# EAGLE design HTVC8038_4LayerBoard_v3 (EAGLE 7.4.0)
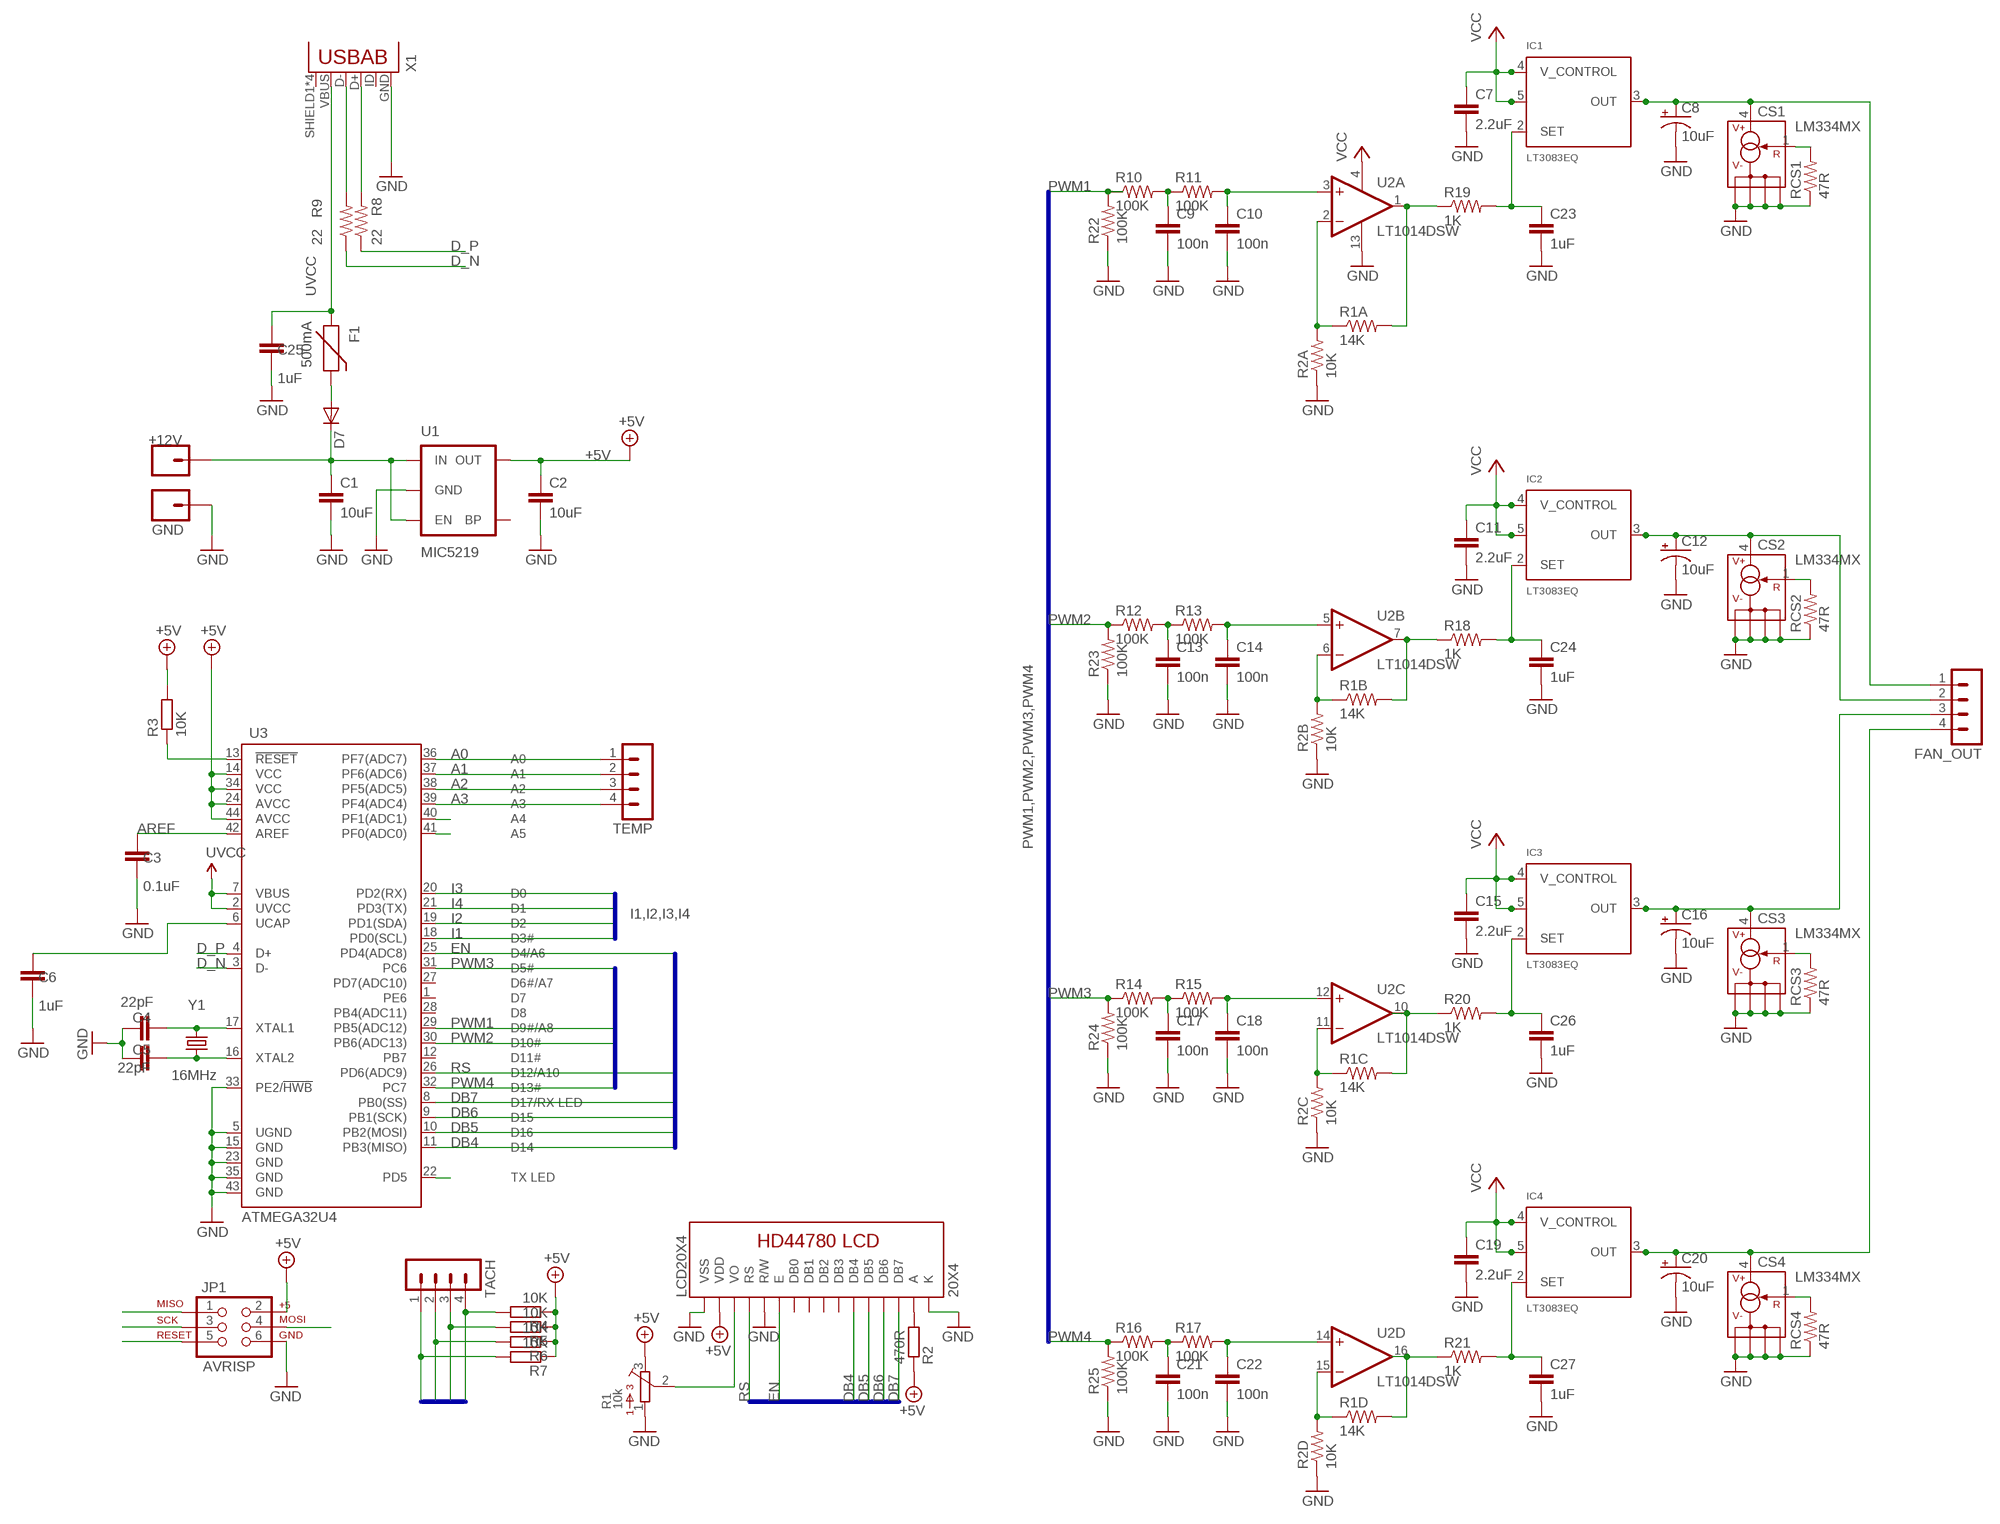
[diagram p0: schematic, sheet 1]

## Parts
+12V  +12V  M01PTH  [1X01]
C1  10uF  C-EUC1206  [C1206]
C2  10uF  C-EUC1206  [C1206]
C3  0.1uF  C-EUC0805  [C0805]
C4  22pF  C-EUC0805  [C0805]
C5  22pF  C-EUC0805  [C0805]
C6  1uF  C-EUC0805  [C0805]
C7  2.2uF  C-EUC1206  [C1206]
C8  10uF  CPOL-USCT3528  [CT3528]
C9  100n  C-EUC0805  [C0805]
C10  100n  C-EUC0805  [C0805]
C11  2.2uF  C-EUC1206  [C1206]
C12  10uF  CPOL-USCT3528  [CT3528]
C13  100n  C-EUC0805  [C0805]
C14  100n  C-EUC0805  [C0805]
C15  2.2uF  C-EUC1206  [C1206]
C16  10uF  CPOL-USCT3528  [CT3528]
C17  100n  C-EUC0805  [C0805]
C18  100n  C-EUC0805  [C0805]
C19  2.2uF  C-EUC1206  [C1206]
C20  10uF  CPOL-USCT3528  [CT3528]
C21  100n  C-EUC0805  [C0805]
C22  100n  C-EUC0805  [C0805]
C23  1uF  C-EUC0805  [C0805]
C24  1uF  C-EUC0805  [C0805]
C25  1uF  C-EUC0805  [C0805]
C26  1uF  C-EUC0805  [C0805]
C27  1uF  C-EUC0805  [C0805]
CS1  LM334MX  [SO08]
CS2  LM334MX  [SO08]
CS3  LM334MX  [SO08]
CS4  LM334MX  [SO08]
D7  DIODESOD  [SOD-323]
F1  500mA  PTCSMD  [PTC-1206]
FAN_OUT  MA04-1  [MA04-1]
GND  GND  M01PTH  [1X01]
IC1  LT3083EQ  [DDPAK_TO263-5]
IC2  LT3083EQ  [DDPAK_TO263-5]
IC3  LT3083EQ  [DDPAK_TO263-5]
IC4  LT3083EQ  [DDPAK_TO263-5]
JP1  AVRISP  AVR_SPI_PRG_6NS  [2X3-NS]
LCD20X4  20X4  LCD-HD447804-HOLES20X4-4HOLES  [LCD-20X4-4HOLES]
R1  10k  3362P  [3362P]
R1A  14K  R-US_R0603  [R0603]
R1B  14K  R-US_R0603  [R0603]
R1C  14K  R-US_R0603  [R0603]
R1D  14K  R-US_R0603  [R0603]
R2  470R  R-EU_R0805  [R0805]
R2A  10K  R-US_R0805  [R0805]
R2B  10K  R-US_R0805  [R0805]
R2C  10K  R-US_R0805  [R0805]
R2D  10K  R-US_R0805  [R0805]
R3  10K  R-EU_R0805  [R0805]
R4  10K  R-EU_R0805  [R0805]
R5  10K  R-EU_R0805  [R0805]
R6  10K  R-EU_R0805  [R0805]
R7  10K  R-EU_R0805  [R0805]
R8  22  R-US_R0603  [R0603]
R9  22  R-US_R0603  [R0603]
R10  100K  R-US_R0805  [R0805]
R11  100K  R-US_R0805  [R0805]
R12  100K  R-US_R0805  [R0805]
R13  100K  R-US_R0805  [R0805]
R14  100K  R-US_R0805  [R0805]
R15  100K  R-US_R0805  [R0805]
R16  100K  R-US_R0805  [R0805]
R17  100K  R-US_R0805  [R0805]
R18  1K  R-US_R0805  [R0805]
R19  1K  R-US_R0805  [R0805]
R20  1K  R-US_R0805  [R0805]
R21  1K  R-US_R0805  [R0805]
R22  100K  R-US_R0805  [R0805]
R23  100K  R-US_R0805  [R0805]
R24  100K  R-US_R0805  [R0805]
R25  100K  R-US_R0805  [R0805]
RCS1  47R  R-US_R0805  [R0805]
RCS2  47R  R-US_R0805  [R0805]
RCS3  47R  R-US_R0805  [R0805]
RCS4  47R  R-US_R0805  [R0805]
TACH  MA04-1  [MA04-1]
TEMP  MA04-1  [MA04-1]
U1  MIC5219  V_REG_LDOSMD  [SOT23-5]
U2  LT1014DSW  [SO16W]
U3  ATMEGA32U4  ATMEGA32U4TQFP  [SPARKFUN-DIGITALIC_TQFP44]
X1  USB-AB  [USB-AB-MICRO-SMD]
Y1  16MHz  CRYSTAL5X3  [CRYSTAL-SMD-5X3]

## Nets
+5V: C2.1 JP1.2 LCD20X4.P$2(VDD) R1.3 R2.1 R3.2 R4.1 R5.1 R6.1 R7.1 U1.5(OUT) U3.14(VCC) U3.24(AVCC) U3.34(VCC) U3.44(AVCC)
A0: TEMP.1 U3.36(PF7(ADC7))
A1: TEMP.2 U3.37(PF6(ADC6))
A2: TEMP.3 U3.38(PF5(ADC5))
A3: TEMP.4 U3.39(PF4(ADC4))
A4: U3.40(PF1(ADC1))
A5: U3.41(PF0(ADC0))
AREF: C3.2 U3.42(AREF)
D_N: R9.1 U3.3(D-)
D_P: R8.1 U3.4(D+)
DB4: JP1.1 LCD20X4.P$11(DB4) U3.11(PB3(MISO))
DB5: JP1.4 LCD20X4.P$12(DB5) U3.10(PB2(MOSI))
DB6: JP1.3 LCD20X4.P$13(DB6) U3.9(PB1(SCK))
DB7: LCD20X4.P$14(DB7) U3.8(PB0(SS))
EN: LCD20X4.P$6(E) U3.25(PD4(ADC8))
GND: C1.2 C2.2 C3.1 C4.2 C5.2 C6.1 C7.2 C8.- C9.2 C10.2 C11.2 C12.- C13.2 C14.2 C15.2 C16.- C17.2 C18.2 C19.2 C20.- C21.2 C22.2 C23.2 C24.2 C25.1 C26.2 C27.2 CS1.2(V-) CS1.3(V-) CS1.6(V-) CS1.7(V-) CS2.2(V-) CS2.3(V-) CS2.6(V-) CS2.7(V-) CS3.2(V-) CS3.3(V-) CS3.6(V-) CS3.7(V-) CS4.2(V-) CS4.3(V-) CS4.6(V-) CS4.7(V-) GND.1 JP1.6 LCD20X4.P$1(VSS) LCD20X4.P$5(R/W) LCD20X4.P$16(K) R1.1 R2A.1 R2B.1 R2C.1 R2D.1 R22.1 R23.1 R24.1 R25.1 RCS1.1 RCS2.1 RCS3.1 RCS4.1 U1.2(GND) U2.13(P:V-) U3.5(UGND) U3.15(GND) U3.23(GND) U3.33(PE2/!HWB) U3.35(GND) U3.43(GND) X1.GND
I1: R7.2 TACH.1 U3.18(PD0(SCL))
I2: R6.2 TACH.2 U3.19(PD1(SDA))
I3: R5.2 TACH.3 U3.20(PD2(RX))
I4: R4.2 TACH.4 U3.21(PD3(TX))
N$1: R1A.1 R2A.2 U2.2(A:-IN)
N$2: R1B.1 R2B.2 U2.6(B:-IN)
N$3: R1C.1 R2C.2 U2.11(C:-IN)
N$4: R1D.1 R2D.2 U2.15(D:-IN)
N$5: C9.1 R10.2 R11.1
N$6: C13.1 R12.2 R13.1
N$7: LCD20X4.P$3(VO) R1.2
N$8: LCD20X4.P$15(A) R2.2
N$9: C5.1 U3.16(XTAL2) Y1.1
N$10: C4.1 U3.17(XTAL1) Y1.3
N$11: D7.2(A) F1.2
N$12: C6.2 U3.6(UCAP)
N$15: C17.1 R14.2 R15.1
N$16: C21.1 R16.2 R17.1
N$18: CS1.1(R) RCS1.2
N$19: CS2.1(R) RCS2.2
N$20: CS3.1(R) RCS3.2
N$21: CS4.1(R) RCS4.2
N$22: C27.1 IC4.2(SET) R21.2
N$23: C23.1 IC1.2(SET) R19.2
N$24: R1B.2 R18.1 U2.7(B:OUT)
N$25: C26.1 IC3.2(SET) R20.2
OPAMP1: C10.1 R11.2 U2.3(A:+IN)
OPAMP2: C14.1 R13.2 U2.5(B:+IN)
OPAMP3: C18.1 R15.2 U2.12(C:+IN)
OPAMP4: C22.1 R17.2 U2.14(D:+IN)
OUT1: C8.+ CS1.4(V+) FAN_OUT.1 IC1.3(OUT) IC1.6(OUT)
OUT2: C12.+ CS2.4(V+) FAN_OUT.2 IC2.3(OUT) IC2.6(OUT)
OUT3: C16.+ CS3.4(V+) FAN_OUT.3 IC3.3(OUT) IC3.6(OUT)
OUT4: C20.+ CS4.4(V+) FAN_OUT.4 IC4.3(OUT) IC4.6(OUT)
PWM1: R10.1 R22.2 U3.29(PB5(ADC12))
PWM2: R12.1 R23.2 U3.30(PB6(ADC13))
PWM3: R14.1 R24.2 U3.31(PC6)
PWM4: R16.1 R25.2 U3.32(PC7)
RESET: JP1.5 R3.1 U3.13(!RESET)
RS: LCD20X4.P$4(RS) U3.26(PD6(ADC9))
SET1: R1A.2 R19.1 U2.1(A:OUT)
SET2: C24.1 IC2.2(SET) R18.2
SET3: R1C.2 R20.1 U2.10(C:OUT)
SET4: R1D.2 R21.1 U2.16(D:OUT)
TXLED: U3.22(PD5)
USB_N: R9.2 X1.D-
USB_P: R8.2 X1.D+
UVCC: C25.2 F1.1 U3.2(UVCC) U3.7(VBUS) X1.VBUS
VCC: +12V.1 C1.1 C7.1 C11.1 C15.1 C19.1 D7.1(C) IC1.4(V_CONTROL) IC1.5(IN) IC2.4(V_CONTROL) IC2.5(IN) IC3.4(V_CONTROL) IC3.5(IN) IC4.4(V_CONTROL) IC4.5(IN) U1.1(IN) U1.3(EN) U2.4(P:V+)
Unconnected: LCD20X4.P$7(DB0) LCD20X4.P$8(DB1) LCD20X4.P$9(DB2) LCD20X4.P$10(DB3) U1.4(BP) U3.1(PE6) U3.12(PB7) U3.27(PD7(ADC10)) U3.28(PB4(ADC11)) X1.ID(USBID) X1.SHIELD1(SHIELD) X1.SHIELD2(SHIELD) X1.SHIELD3(SHIELD) X1.SHIELD4(SHIELD)

## Buses
RS,EN,DB4,DB5,DB6,DB7
PWM1,PWM2,PWM3,PWM4
I1,I2,I3,I4

## Library data of the parts
+12V GND = SparkFun-Connectors:M01: Header 1 Standard 1-pin 0.1" header. Use with straight break away headers (SKU : PRT-00116), right angle break away headers (PRT-00553), swiss pins (PRT-00743), machine pins (PRT-00117), and female headers (PRT-00115).
C1-C7 C11 C15 C19 C25 = rcl:C-EU: CAPACITOR, European symbol
C8 C12 C16 C20 = rcl:CPOL-US: POLARIZED CAPACITOR, American symbol
C9 C10 C13 C14 C17 C18 C21-C24 C26 C27 = resistor:C-EU: CAPACITOR, European symbol
CS1-CS4 = linear:LM334*: 3-Terminal Adjustable Current Sources Source: www.national.com/pf/LM/LM334.html | LM134.pdf
D7 = SparkFun:DIODE: Diode These are standard reverse protection diodes and small signal diodes. SMA package can handle up to about 1A. SOD-323 can handle about 200mA. What the SOD-323 package when ordering, there are some mfgs out there that are 5-pin packages.
F1 = SparkFun:PTC: Resettable Fuse PTC Resettable Fuse. Spark Fun Electronics SKU : COM-08357
FAN_OUT TACH TEMP = con-lstb:MA04-1: PIN HEADER; OC_FARNELL: unknown; OC_NEWARK: unknown
IC1-IC4 = nervus:LT3083
JP1 = SparkFun-Connectors:AVR_SPI_PRG_6: AVR ISP 6 Pin This is the reduced ISP connector for AVR programming. Common on Arduino. This footprint will take up less PCB space and can be used with a 10-pin to 6-pin adapter such as SKU: BOB-08508 **Special note about "TEST_POINT" package. The stop mask is on the top side, so if you want your programming test points to be on the bottom of your board, make sure to place this package on the bottom side of the board. This also ensure that the orientation to program from the bottom side will be correct.
LCD20X4 = HD44780LCD-2:LCD-HD44780
R1 = nervus:3362: 3362 Series 1/4" Square Trimmer
R1A R1B R1C R1D R8 R9 = rcl:R-US_: RESISTOR, American symbol
R2-R7 = rcl:R-EU_: RESISTOR, European symbol
R2A R2B R2C R2D R10-R25 RCS1-RCS4 = resistor:R-US_: RESISTOR, American symbol
U1 = SparkFun:V_REG_LDO: Voltage Regulator LDO Standard 150mA LDO voltage regulator in SOT-23 layout. Micrel part MIC5205. BP (by-pass) pin is used to lower output noise with 470pF cap.
U2 = nervus:LT1014: Quad Precision Op AmpDatasheet <http://cds.linear.com/docs/en/datasheet/10134fd.pdf>
U3 = SparkFun-Retired:ATMEGA32U4: Atmel 44-pin 8-bit Microcontroller with 32KBytes of ISP Flash and USB Controller ----- Please use the QFN-44-NOPAD_1:1 package for the footprint of all boards using a 32U4. Route traces directly away from the pads as much as possible.; PROD_ID: IC-11161
X1 = nervus:USB-AB: This is a USB AB connector that is compatible with USB OTG. i.e. this connector can serve as a host or device
Y1 = SparkFun:CRYSTAL: Crystals Various standard crystals. Proven footprints. Spark Fun Electronics SKU : COM-00534

## Net classes
0 default: width 0.203 mm
1 VCC: width 0.813 mm, drill 0.406 mm, clearance 0.406 mm
2 GND: width 0.813 mm, drill 0.406 mm, clearance 0.406 mm

## Board
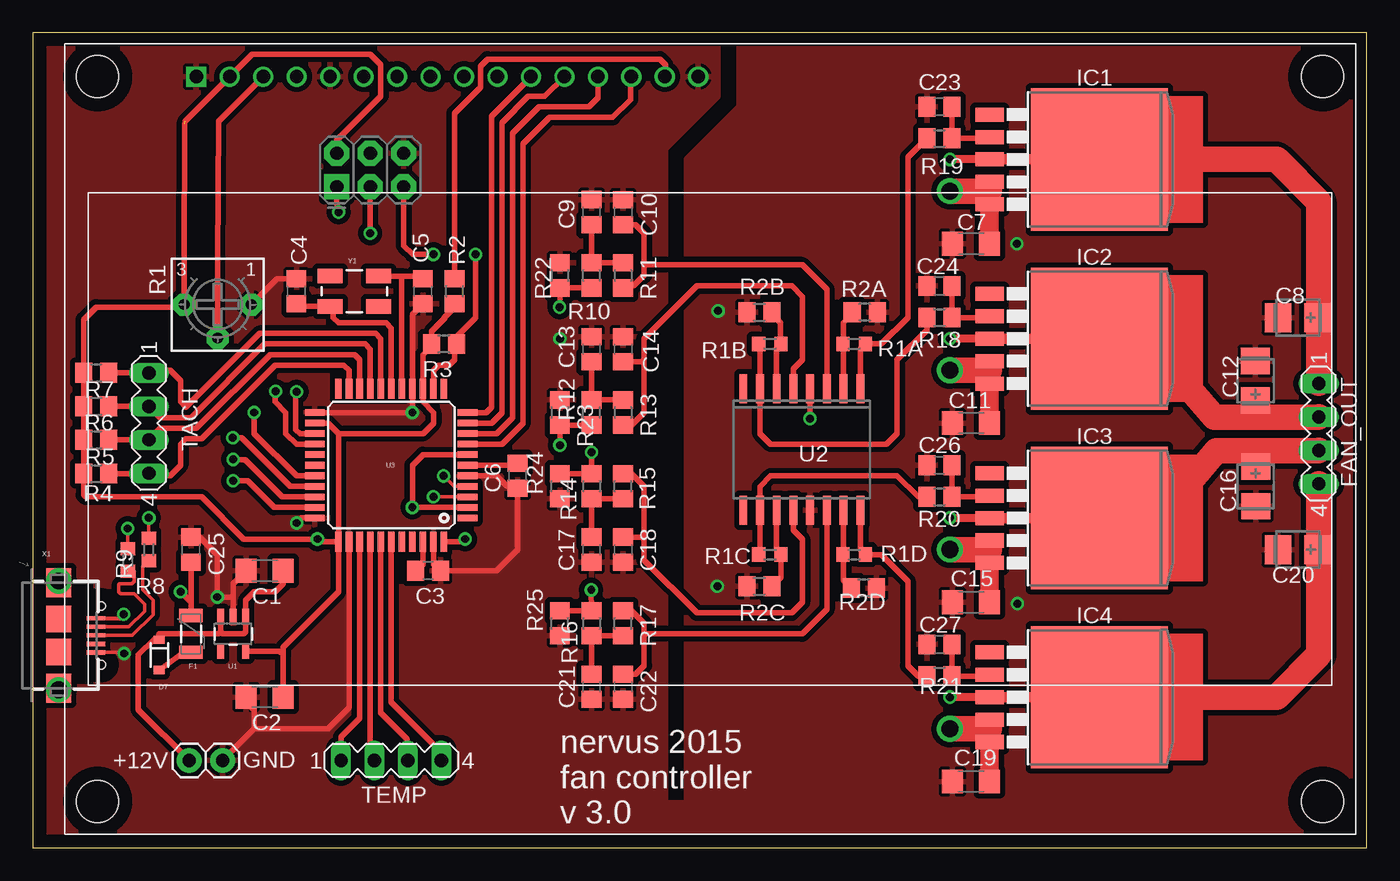
[diagram p1: board, top side]
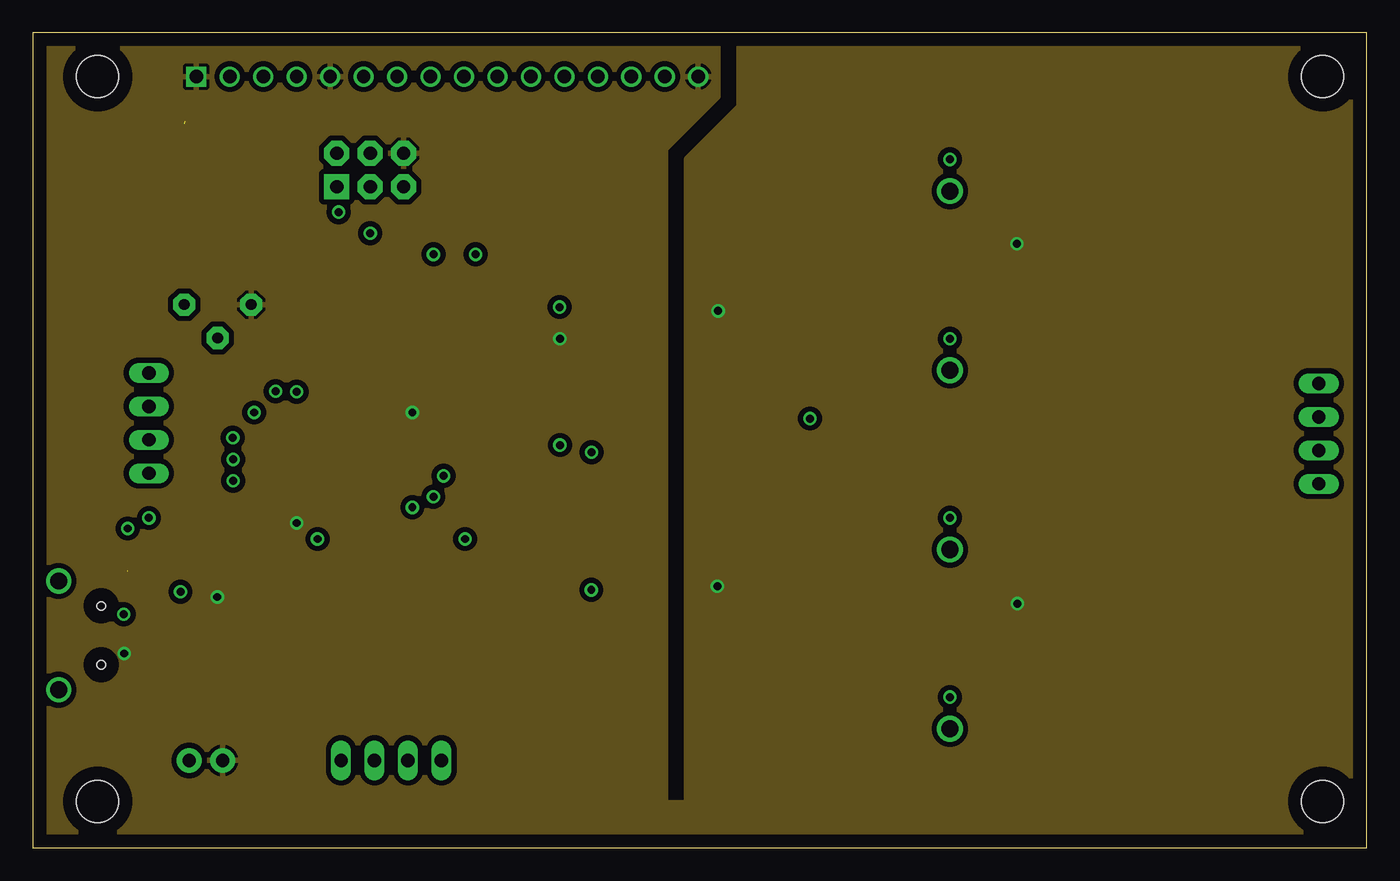
[diagram p2: board, inner layer GND]
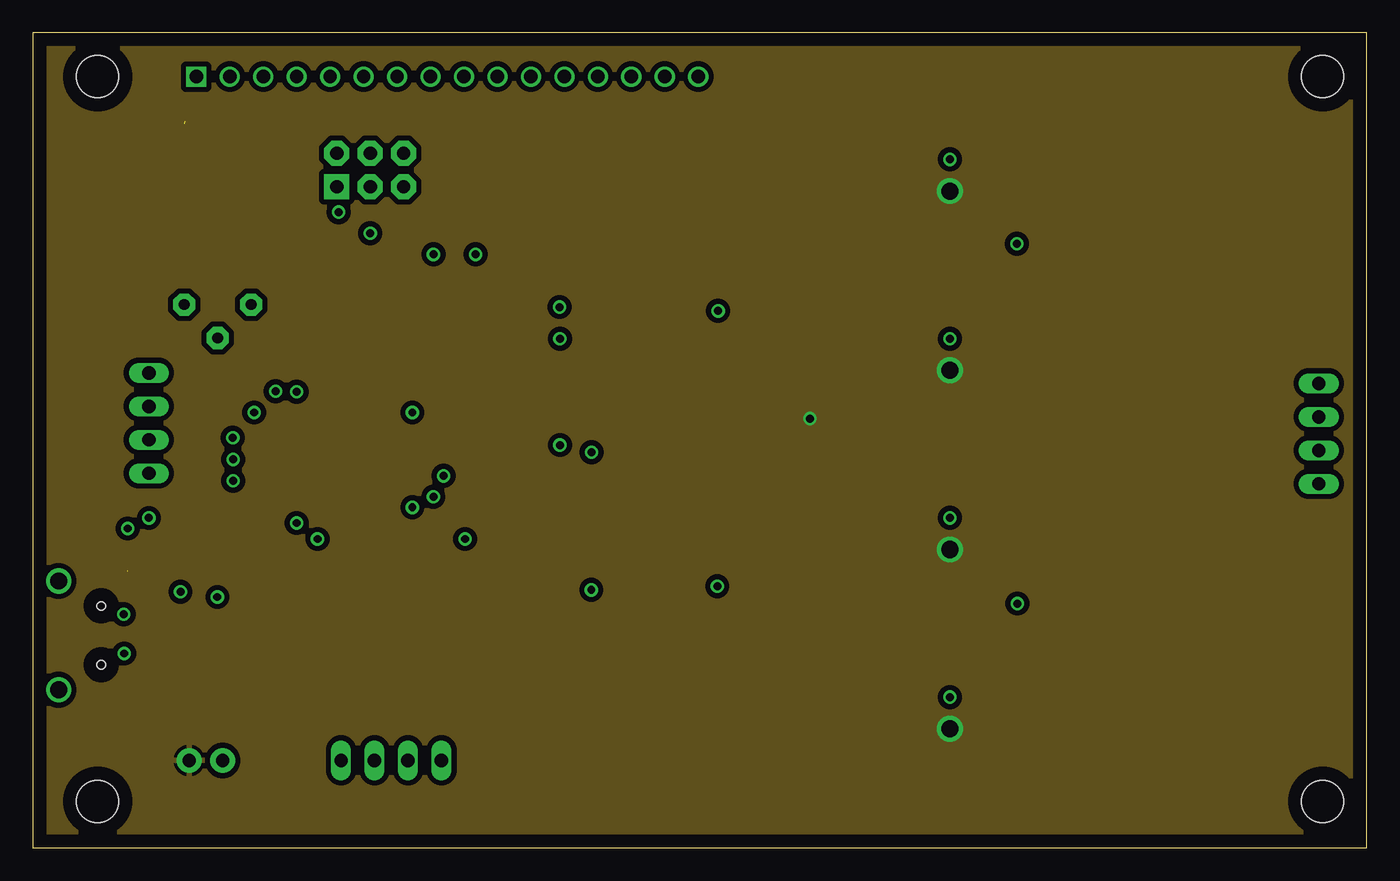
[diagram p3: board, inner layer VCC]
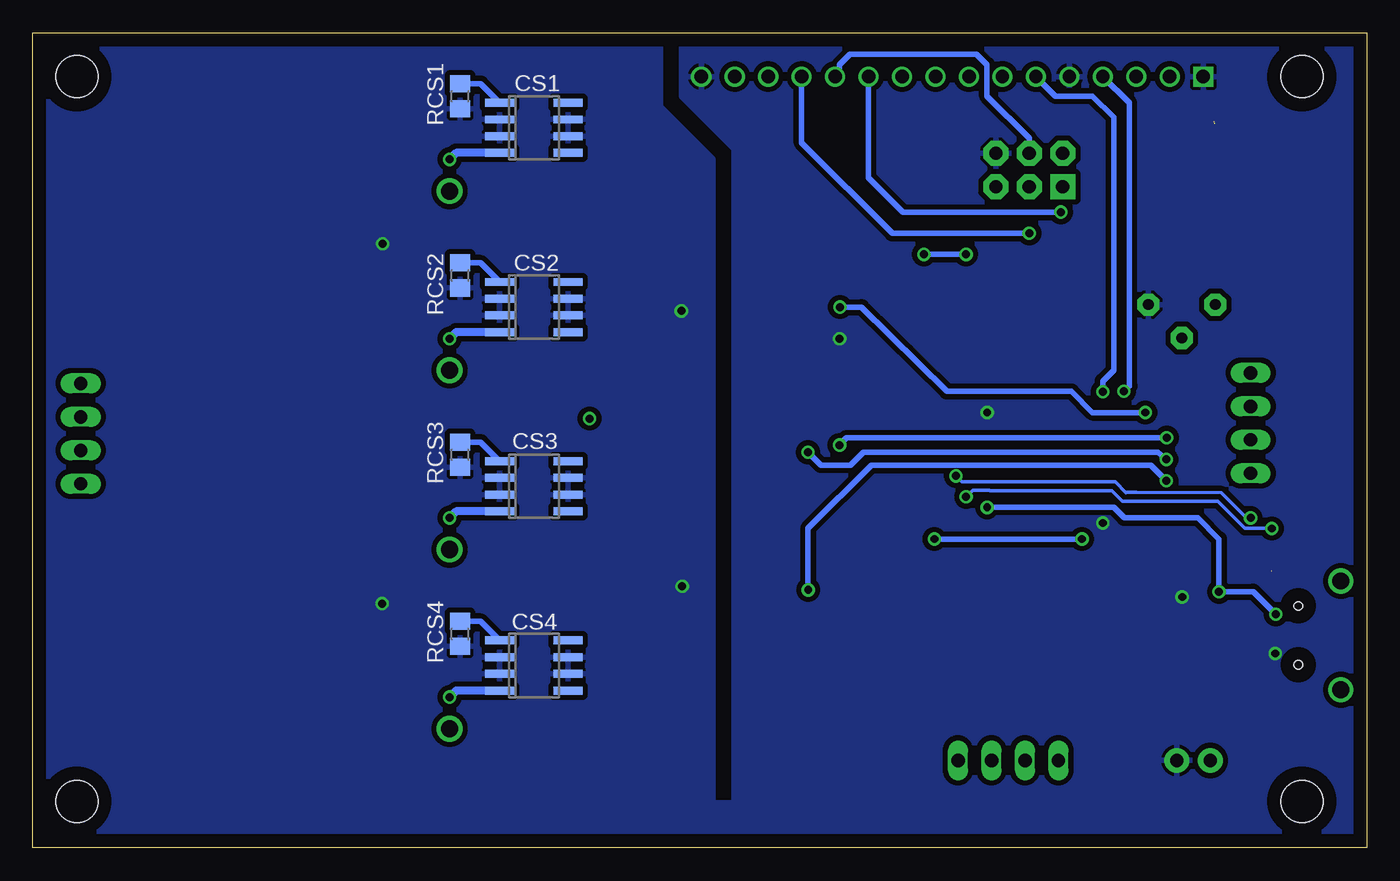
[diagram p4: board, bottom side, seen from below]

Size 101.23 x 61.82 mm. Coordinates in mm from the lower left corner, seen from the top.
Outline: 0,0 101.23,0 101.23,61.82 0,61.82 0,0
Copper layers (1*2*15*16): Top 0.035mm / dielectric 1.5mm / GND 0.035mm / dielectric 0.15mm / VCC 0.035mm / dielectric 0.2mm / Bottom 0.035mm
Design rules "default *": minimum track width 10mil, minimum drill 24mil, track to track 0.4mm, track to pad 0.4mm, pad to pad 0.4mm, via to via 0.4mm, smd to smd 0.4mm, copper to edge 40mil, drill to drill 8mil, minimum pad ring 10mil, minimum via ring 8mil, stop-mask expansion 4mil, vias tented up to drill 0mil, thermal gap 10mil

### Footprints (pad centres in the part's own frame; a part is rotated, then mirrored left to right if it is on the bottom)
1X01 = drill 1.016 pad 1.88: 1 0,0
C1206 = smd 1.6 x 1.8: 1 -1.4,0; 2 1.4,0
C0805 = smd 1.3 x 1.5: 1 -0.95,0; 2 0.95,0
CT3528 = smd 2 x 2.2: + -1.5,0; - 1.5,0
SO08 = smd 0.6 x 2.2: 1 -1.905,-2.6; 2 -0.635,-2.6; 3 0.635,-2.6; 4 1.905,-2.6; 5 1.905,2.6; 6 0.635,2.6; 7 -0.635,2.6; 8 -1.905,2.6
SOD-323 = smd 0.63 x 0.83: 1 -1.15,0; 2 1.15,0
PTC-1206 = smd 1 x 1.8: 1 -1.4,0; 2 1.4,0
MA04-1 = drill 1.016 long: 1 -3.81,0; 2 -1.27,0; 3 1.27,0; 4 3.81,0
DDPAK_TO263-5 = smd 1.067 x 2.159: 1 -3.404,-5.791; 2 -1.702,-5.791; 3 0,-5.791; 4 1.702,-5.791; 5 3.404,-5.791 | smd 10.8 x 10.41: 6 0,2.54
2X3-NS = drill 1.016 pad 1.88 square: 1 -2.54,-1.27 | drill 1.016 pad 1.88 octagon: 2 -2.54,1.27; 3 0,-1.27; 4 0,1.27; 5 2.54,-1.27; 6 2.54,1.27
LCD-20X4-4HOLES = drill 1.016 square: P$1 10,57.5 | drill 1.016: P$2 12.54,57.5; P$3 15.08,57.5; P$4 17.62,57.5; P$5 20.16,57.5; P$6 22.7,57.5; P$7 25.24,57.5; P$8 27.78,57.5; P$9 30.32,57.5; P$10 32.86,57.5; P$11 35.4,57.5; P$12 37.94,57.5; P$13 40.48,57.5; P$14 43.02,57.5; P$15 45.56,57.5; P$16 48.1,57.5 | hole 3.2: 2.5,2.5; 2.5,57.5; 95.5,57.5; 95.5,2.5
3362P = drill 0.813 pad 1.676 octagon: 1 -2.54,0; 2 0,2.54; 3 2.54,0
R0603 = smd 1 x 1.1: 1 -0.85,0; 2 0.85,0
R0805 = smd 1.3 x 1.5: 1 -0.95,0; 2 0.95,0
SOT23-5 = smd 0.55 x 1.2: 1 -0.95,-1.3; 2 0,-1.3; 3 0.95,-1.3; 4 0.95,1.3; 5 -0.95,1.3
SO16W = smd 0.6 x 2.2: 1 -4.445,-4.6; 2 -3.175,-4.6; 3 -1.905,-4.6; 4 -0.635,-4.6; 5 0.635,-4.6; 6 1.905,-4.6; 7 3.175,-4.6; 8 4.445,-4.6; 9 4.445,4.6; 10 3.175,4.6; 11 1.905,4.6; 12 0.635,4.6; 13 -0.635,4.6; 14 -1.905,4.6; 15 -3.175,4.6; 16 -4.445,4.6
SPARKFUN-DIGITALIC_TQFP44 = smd 1.5 x 0.5: 1 -5.8,4; 2 -5.8,3.2; 3 -5.8,2.4; 4 -5.8,1.6; 5 -5.8,0.8; 6 -5.8,0; 7 -5.8,-0.8; 8 -5.8,-1.6; 9 -5.8,-2.4; 10 -5.8,-3.2; 11 -5.8,-4; 23 5.8,-4; 24 5.8,-3.2; 25 5.8,-2.4; 26 5.8,-1.6; 27 5.8,-0.8; 28 5.8,0; 29 5.8,0.8; 30 5.8,1.6; 31 5.8,2.4; 32 5.8,3.2; 33 5.8,4 | smd 0.5 x 1.5: 12 -4,-5.8; 13 -3.2,-5.8; 14 -2.4,-5.8; 15 -1.6,-5.8; 16 -0.8,-5.8; 17 0,-5.8; 18 0.8,-5.8; 19 1.6,-5.8; 20 2.4,-5.8; 21 3.2,-5.8; 22 4,-5.8; 34 4,5.8; 35 3.2,5.8; 36 2.4,5.8; 37 1.6,5.8; 38 0.8,5.8; 39 0,5.8; 40 -0.8,5.8; 41 -1.6,5.8; 42 -2.4,5.8; 43 -3.2,5.8; 44 -4,5.8
USB-AB-MICRO-SMD = smd 1.4 x 0.318: D+ 2.85,0; D- 2.85,0.65; GND 2.85,-1.3; ID 2.85,-0.65; VBUS 2.85,1.3 | drill 1.27: P$1 0,4.128; P$2 0,-4.128 | smd 1.9 x 2.2: SHIELD1 0,4; SHIELD4 0,-4 | smd 1.9 x 2: SHIELD2 0,1.25; SHIELD3 0,-1.25 | hole 0.635: 3.226,2.235; 3.226,-2.235
CRYSTAL-SMD-5X3 = smd 1.9 x 1.1: 1 -1.85,-1.15; 2 1.85,-1.15; 3 1.85,1.15; 4 -1.85,1.15

### Placement (x,y rotation side)
+12V  11.86,6.62 0 top
C1  17.6,21.02 180 top
C2  17.6,11.43 180 top
C3  30,21.02 180 top
C4  20,42.22 90 top
C5  29.6,42.22 270 top
C6  36.79,28.22 90 top
C7  71.2,45.82 180 top
C8  96,40.21 180 top
C9  42.4,48.23 90 top
C10  44.8,48.22 90 top
C11  71.2,32.22 180 top
C12  92.79,35.42 90 top
C13  42.4,37.82 90 top
C14  44.8,37.82 90 top
C15  71.2,18.62 180 top
C16  92.81,27.41 270 top
C17  42.4,22.62 270 top
C18  44.8,22.62 270 top
C19  71.2,5.02 180 top
C20  96.01,22.62 180 top
C21  42.4,12.22 270 top
C22  44.8,12.22 270 top
C23  68.8,56.22 180 top
C24  68.8,42.62 180 top
C25  12,22.62 270 top
C26  68.8,29.02 180 top
C27  68.8,15.42 180 top
CS1  63.2,54.62 270 bottom
CS2  63.2,41.02 270 bottom
CS3  63.2,27.42 270 bottom
CS4  63.2,13.82 270 bottom
D7  9.6,14.62 270 top
F1  12,16.22 270 top
FAN_OUT  97.6,31.42 270 top
GND  14.4,6.62 0 top
IC1  78.4,52.22 270 top
IC2  78.4,38.62 270 top
IC3  78.4,25.01 270 top
IC4  78.4,11.42 270 top
JP1  25.6,51.42 0 top
LCD20X4  2.4,1.01 0 top
R1  14.02,41.21 180 top
R1A  62.34,38.23 0 top
R1B  55.94,38.23 180 top
R1C  55.94,22.23 180 top
R1D  62.34,22.23 0 top
R2  32,42.22 90 top
R2A  63.14,40.63 180 top
R2B  55.14,40.63 0 top
R2C  55.14,19.83 0 top
R2D  63.07,19.7 180 top
R3  31.2,38.22 180 top
R4  4.8,28.39 0 top
R5  4.8,30.96 0 top
R6  4.8,33.5 0 top
R7  4.8,36.04 0 top
R8  8.8,22.62 270 top
R9  7.2,21.82 270 top
R10  42.4,43.42 90 top
R11  44.8,43.42 270 top
R12  42.4,33.02 90 top
R13  44.8,33.02 270 top
R14  42.4,27.42 270 top
R15  44.8,27.42 90 top
R16  42.4,17.02 270 top
R17  44.8,17.02 90 top
R18  68.8,40.22 0 top
R19  68.8,53.82 0 top
R20  68.8,26.62 0 top
R21  68.8,13.02 0 top
R22  40,43.42 270 top
R23  40,33.02 270 top
R24  40,27.42 90 top
R25  40,17.02 90 top
RCS1  68.8,57.02 90 bottom
RCS2  68.8,43.42 90 bottom
RCS3  68.8,29.82 90 bottom
RCS4  68.8,16.22 90 bottom
TACH  8.8,32.22 270 top
TEMP  27.2,6.62 0 top
U1  15.2,16.22 180 top
U2  58.36,30.22 180 top
U3  27.2,29.02 180 top
X1  1.95,16.11 0 top
Y1  24.4,42.22 180 top

### Tracks (layer width: path | path; a pad name or v marks a point on that pad's centre or on a via)
+5V  (via drill 0.6)  (1 unrouted)
  Top 0.406: U3.34 23.2,31.42 | 23.2,31.42 22.4,32.22 U3.24 | 11.51,54.94 11.48,44.65 R1.3 11.29,41.02 4.8,41.02 3.85,40.07 R7.1 R6.1 R5.1 | 23.2,31.42 29.6,31.42 30.4,32.22 30.4,33.02 29.6,33.82 U3.14 29.6,37.42 30.4,38.22 30.4,37.67 R3.2 30.27,38.24 30.27,39.2 31.29,40.22 31.2,40.22 32,41.02 R2.1 | C2.1 19,14.62 | 19,14.62 19,15.22 23.2,19.42 U3.34 | 19,14.62 18.7,14.92 U1.5 | R4.1 R5.1 | R5.1 3.85,26.77 4,26.62 12.8,26.62 16,23.42 v21.6,23.42 21.8,23.22 U3.34 | 11.56,55.13 LCD20X4.P$2 16.65,60.22 25.6,60.22 26.4,59.42 26.4,57.02 23.06,53.68 JP1.2 | U3.44 32.6,23.22 v32.8,23.42
  Bottom 0.406: v32.8,23.42 v21.6,23.42
A0
  Top 0.406: TEMP.1 23.39,8.41 24.8,9.82 U3.36
A1
  Top 0.406: U3.37 25.6,6.95 TEMP.2
A2
  Top 0.406: U3.38 26.4,10.22 28.4,8.22 28.4,6.69 TEMP.3
A3
  Top 0.406: TEMP.4 31.01,7.21 27.2,11.02 U3.39
AREF
  Top 0.406: U3.42 29.6,21.47 C3.2
D_N  (via drill 0.6)
  Top 0.254: R9.1 v7.2,24.22 | v30.4,26.62 U3.3
  Bottom 0.254: v30.4,26.62 29.9,27.12 28.62,27.12 28.59,27.09 19.34,27.09 18.54,26.29 11.3,26.29 9.23,24.22 v7.2,24.22
D_P  (via drill 0.6)
  Top 0.254: R8.1 v8.8,25.02 | U3.4 31.96,27.42 v31.17,28.21
  Bottom 0.254: v31.17,28.21 30.71,27.75 19.07,27.75 18.27,26.95 18.26,26.95 17.46,26.95 11.03,26.93 9.14,25.02 v8.8,25.02
DB4  (via drill 0.61 pad 0.25)
  Top 0.406: U3.11 34.4,33.02 34.8,33.42 34.8,55.51 LCD20X4.P$11 | JP1.1 23.06,48.88 v23.2,48.22
  Bottom 0.406: v23.2,48.22 35.2,48.22 37.8,50.82 LCD20X4.P$11
DB5
  Top 0.406: U3.10 34.8,32.22 35.6,33.02 35.6,55.02 37.6,57.02 38.85,57.02 LCD20X4.P$12
  Bottom 0.406: JP1.4 25.6,53.82 28.8,57.02 28.8,59.42 29.6,60.22 39.2,60.22 40,59.42 40,58.85 LCD20X4.P$12
DB6  (via drill 0.61 pad 0.25)
  Top 0.406: U3.9 35.2,31.42 36.4,32.62 36.4,54.22 38.4,56.22 42.2,56.22 42.88,56.9 LCD20X4.P$13 | JP1.3 v25.6,46.62
  Bottom 0.406: v25.6,46.62 36,46.62 42.88,53.5 LCD20X4.P$13
DB7
  Top 0.406: U3.8 35.6,30.62 37.2,32.22 37.2,53.42 39.2,55.42 44,55.42 45.35,56.77 45.35,58.44 LCD20X4.P$14
EN  (via drill 0.6)
  Top 0.406: U3.25 20.27,31.42 19.96,31.73 19.96,34.53 v20.02,34.59
  Bottom 0.406: v20.02,34.59 20.02,35.4 19.2,36.22 19.2,55.42 20.8,57.02 23.61,57.02 LCD20X4.P$6
GND  (via drill 0.6)
  Top 0.254: v6.92,14.73 6.84,14.81 X1.GND
  Top 0.406: 30.64,20.65 C3.1 | U1.2 15.2,19.02 | 15.2,19.02 15.2,20.02 C1.2 | 15.2,19.02 v14,19.02 14,22.22 12.4,23.82 12.25,23.82 C25.1 | U3.43 30.4,21.47 C3.1 | U3.23 v28.8,33.02 U3.15 28.8,40.47 C5.2 | R1.1 18.52,43.17 C4.2 | C3.1 35.2,21.02 36.79,22.61 36.79,23.43 | U3.5 35.2,28.22 36,27.42 36.64,27.42 C6.1 36.79,23.43 | 36.79,23.43 36.8,23.42 | U3.35 24,10.62 22.4,9.02 16.8,9.02 | U3.33 20.4,25.02 v20.01,24.63 | C2.2 16,11.23 16.8,10.43 16.8,9.02 | GND.1 16.8,9.02
  other vias: 51.95,19.83 52.01,40.73 74.69,45.83 74.73,18.52 40,38.62
  pour GND: 0,61.82 51.2,61.82 52,61.02 52,57.02 48,53.02 48,3.42 49.6,3.42 49.6,52.22 53.6,56.22 53.6,61.02 54.4,61.82 101.6,61.82 101.6,0.22 0,0.22
  pour Top (isolate 0.406): 0,61.82 51.2,61.82 52,61.02 52,57.02 48,53.02 48,3.42 49.6,3.42 49.6,52.22 53.6,56.22 53.6,61.02 54.4,61.82 101.6,61.82 101.6,0.22 0,0.22 0,12.22 4.8,12.22 4.8,20.22 0,20.22
  pour Bottom: 0,61.82 0,0.22 101.6,0.22 101.6,61.82 54.4,61.82 53.6,61.02 53.6,56.22 49.6,52.22 49.6,3.42 48,3.42 48,53.02 52,57.02 52,61.02 51.2,61.82
I1
  Top 0.406: U3.18 26.4,38.62 26,39.02 17.2,39.02 11.6,33.42 11.2,33.82 11.2,35.42 10.4,36.22 8.99,36.22 TACH.1 R7.2
I2
  Top 0.406: U3.19 25.6,37.82 25.2,38.22 17.6,38.22 12,32.62 9.67,32.62 TACH.2 R6.2
I3
  Top 0.406: U3.20 24.8,37.02 24.4,37.42 18,37.42 12.4,31.82 9.67,31.82 TACH.3 R5.2
I4
  Top 0.406: U3.21 24,36.22 23.6,36.62 18.4,36.62 12.8,31.02 11.6,31.02 11.2,30.62 11.2,29.02 10.4,28.22 8.99,28.22 TACH.4 8.78,28.39 R4.2
N$1
  Top 0.406: U2.2 61.54,38.18 R1A.1 61.54,38.28 61.54,39.83 62.19,40.48 R2A.2
N$2
  Top 0.406: U2.6 56.45,37.9 R1B.1 56.74,38.28 56.74,39.83 56.09,40.48 R2B.2
N$3
  Top 0.406: U2.11 56.45,22.56 R1C.1 56.79,20.53 R2C.2
N$4
  Top 0.406: U2.15 61.54,22.27 | 61.54,22.27 R1D.1 | 61.54,22.27 61.54,20.29 R2D.2
N$5
  Top 0.406: R11.1 R10.2 C9.1
N$6
  Top 0.406: C13.1 R12.2 R13.1
N$7
  Top 0.406: R1.2 14.02,44.65 14.08,55.08 14.08,55.11 LCD20X4.P$3 17.48,58.48
N$8
  Top 0.406: R2.2 32,55.73 33.96,57.69 33.96,59.29 34.5,59.83 47.59,59.83 48,59.42 48,58.55 LCD20X4.P$15
N$9
  Top 0.406: 26,43.02 26.25,43.27 Y1.1 28,43.37 | U3.16 28,43.37 | 28,43.37 29.4,43.37 C5.1
N$10
  Top 0.406: U3.17 27.2,39.42 26.8,39.82 23.2,39.82 22.8,40.22 22.8,40.82 Y1.3 20.2,41.07 C4.1
N$11
  Top 0.406: D7.2 11.75,15.07 F1.2
N$12
  Top 0.406: U3.6 36.64,29.02 C6.2
N$15
  Top 0.406: C17.1 R14.2 R15.1
N$16
  Top 0.406: C21.1 R16.2 R17.1
N$18
  Bottom 0.406: CS1.1 67.24,57.97 RCS1.2
N$19
  Bottom 0.406: CS2.1 67.24,44.37 RCS2.2
N$20
  Bottom 0.406: CS3.1 67.24,30.77 RCS3.2
N$21
  Bottom 0.406: CS4.1 67.24,17.17 RCS4.2
N$22
  Top 0.406: C27.1 R21.2 72.51,13.02 IC4.2
N$23
  Top 0.406: C23.1 R19.2 72.51,53.82 IC1.2
N$24
  Top 0.406: R1B.2 55.19,38.13 U2.7 55.2,34.8 55.2,31.42 56,30.62 64.8,30.62 65.6,31.42 65.6,37.02 67.85,39.27 R18.1
N$25
  Top 0.406: C26.1 R20.2 72.52,26.62 IC3.2
OPAMP1
  Top 0.406: R11.2 44.95,42.62 45.6,42.62 46.4,43.42 46.4,44.22 | C10.1 45.75,47.27 46.4,46.62 46.4,44.22 | U2.3 60.27,42.35 58.4,44.22 46.4,44.22
OPAMP2
  Top 0.406: R13.2 45.45,32.07 46.4,33.02 46.4,37.02 | 46.4,37.02 46.4,38.62 50.4,42.62 57.6,42.62 58.4,41.82 58.4,37.02 57.73,36.35 U2.5 | C14.1 46.25,36.87 46.4,37.02
OPAMP3
  Top 0.406: R15.2 45.45,28.37 46.4,27.42 46.4,23.42 | 46.4,23.42 46.4,21.82 50.4,17.82 57.6,17.82 58.4,18.62 58.4,23.42 57.73,24.09 U2.12 | C18.1 46.25,23.57 46.4,23.42
OPAMP4
  Top 0.406: C22.1 45.75,13.17 46.4,13.82 46.4,16.22 | U2.14 60.27,18.09 58.4,16.22 46.4,16.22 | R17.2 45.45,17.97 46.4,17.02 46.4,16.22
OUT1  (via drill 0.61)
  Top 0.406: C8.+ 97.59,40.21 97.6,40.22
  Top 0.61: IC1.3 v69.6,52.22
  Top 0.813: IC1.3 IC1.6 81.6,52.22
  Top 1.93: 81.6,52.22 94.4,52.22 97.6,49.02 97.6,40.22 FAN_OUT.1
  Bottom 0.61: CS1.4 69.1,52.71 v69.6,52.22
OUT2  (via drill 0.61)
  Top 0.406: C12.+ 94.39,32.66 94.4,32.65
  Top 0.61: IC2.3 v69.6,38.62
  Top 0.813: IC2.3 IC2.6 81.6,38.62
  Top 1.93: 81.6,38.62 84.52,38.62 89.69,32.65 94.4,32.65 97.56,32.65 FAN_OUT.2
  Bottom 0.61: CS2.4 69.1,39.12 v69.6,38.62
OUT3  (via drill 0.61)
  Top 0.406: C16.+ 94.41,30.11 90.4,30.12
  Top 0.61: IC3.3 v69.61,25.01 v69.6,25.02
  Top 0.813: IC3.3 IC3.6
  Top 1.93: IC3.6 85.5,25.01 89.81,30.12 90.4,30.12 97.57,30.12 FAN_OUT.3
  Bottom 0.61: CS3.4 69.1,25.52 v69.6,25.02
OUT4  (via drill 0.61)
  Top 0.406: C20.+ 97.6,22.62
  Top 0.61: IC4.3 v69.6,11.42
  Top 0.813: IC4.3 IC4.6
  Top 1.93: IC4.6 94.4,11.42 97.6,14.62 97.6,22.62 FAN_OUT.4
  Bottom 0.61: CS4.4 69.1,11.91 v69.6,11.42
PWM1  (via drill 0.6)
  Top 0.406: U3.29 20,28.22 16.8,31.42 v16.8,33.02 | 41.66,42.47 R10.1 R22.2 | R22.2 39.52,42.47 | v39.98,41.02 40,41.98 R22.2
  Bottom 0.406: v39.98,41.02 38.34,41.02 31.87,34.62 22.4,34.62 20.8,33.02 v16.8,33.02
PWM2  (via drill 0.6)
  Top 0.406: U3.30 19.52,27.42 15.84,31.1 v15.17,31.1 | v40,30.55 R23.2 R12.1
  Bottom 0.406: v40,30.55 40.05,30.55 39.49,31.1 v15.17,31.1
PWM3  (via drill 0.6)
  Top 0.406: U3.31 18.93,26.62 16.11,29.44 15.21,29.44 v15.19,29.46 | v42.4,30 R14.1 R24.2
  Bottom 0.406: v15.19,29.46 15.84,30 38.18,30.02 39.18,29.02 41.42,29.02 v42.4,30
PWM4  (via drill 0.6)
  Top 0.406: U3.32 18.3,25.82 16.29,27.83 v15.21,27.83 v15.2,27.84 | v42.38,19.56 R16.1 R25.2
  Bottom 0.406: v15.2,27.84 16.38,29.02 37.6,29.02 42.4,24.22 42.4,19.58 v42.38,19.56
RESET  (via drill 0.61 pad 0.25)
  Top 0.406: U3.13 30.4,36.22 30.8,36.62 31.6,36.62 32,37.02 32,37.67 R3.1 32.15,38.77 33.6,40.22 v33.6,45.02 | JP1.5 28.14,45.68 28.8,45.02 v30.4,45.02
  Bottom 0.406: v33.6,45.02 v30.4,45.02
RS  (via drill 0.6)
  Top 0.406: U3.26 20,30.62 19.2,31.42 19.2,33.02 18.4,33.82 18.4,34.62 v18.42,34.64
  Bottom 0.406: v18.42,34.64 18,35.03 18.02,56.5 18.02,56.51 LCD20X4.P$4
SET1
  Top 0.406: U2.1 62.8,37.85 R1A.2 64.41,38.23 66.4,40.22 66.4,52.37 R19.1
SET2
  Top 0.406: C24.1 R18.2 72.51,40.22 IC2.2
SET3
  Top 0.406: R1C.2 55.19,22.33 U2.10 55.19,27.4 56,28.22 65.6,28.22 67.2,26.62 R20.1
SET4
  Top 0.406: U2.16 62.8,22.62 R1D.2 64.39,22.23 66.4,20.22 66.4,13.82 67.2,13.02 R21.1
USB_N  (1 unrouted)
  Top 0.254: X1.D- 7.28,16.76 8.47,17.95 8.47,18.48 7.67,19.29 6.68,19.29 arc-90 6.51,19.5 6.51,19.88 arc-90 6.64,20.04 7.43,20.04 arc90 7.7,20.31 7.7,20.95 7.68,20.97 R9.2 | 7.2,21.02 arc-90 7.01,21.21
USB_P
  Top 0.254: X1.D+ 7.55,16.11 9.13,17.69 9.13,18.76 8.33,19.55 8.33,21.31 R8.2
UVCC  (via drill 0.6)
  Top 0.305: X1.VBUS 6.68,17.41 v6.89,17.71
  Top 0.406: F1.1 12,18.62 | v11.2,19.42 12,18.62 | U3.2 v28.8,25.82 28.8,29.02 29.6,29.82 U3.7 | 12,18.62 C25.2
  Bottom 0.406: v28.8,25.82 19.2,25.82 18.4,25.02 12.8,25.02 11.2,23.42 v11.2,19.42 8.6,19.42 v6.89,17.71
VCC  (via drill 0.6, 1.3)
  Top 0.406: U2.4 59,32.57 v58.98,32.56 | U1.3 14.25,16.37 | 14.25,16.37 14.4,16.22 16,16.22 16.15,16.37 U1.1 16.15,18.77 16.8,19.42 18.4,19.42 19,20.02 C1.1 | 9.55,15.82 D7.1 | +12V.1 8,10.48 8,14.62 9.2,15.82 9.55,15.82 | 9.55,15.82 9.55,16.17 9.6,16.22 14.1,16.22 14.25,16.37
  Top 0.813: IC4.5 72.61,9.02 IC4.4 | IC3.5 72.61,22.62 IC3.4 | IC2.5 72.61,36.22 IC2.4 | IC1.5 72.61,49.82 IC1.4
  Top 1.422: IC2.5 C11.1 | IC1.5 C7.1 | IC3.5 C15.1 | IC4.5 C19.1
  Top 1.93: v69.6,9.02 72.61,9.02 | v69.6,22.62 72.61,22.62 | v69.6,36.22 72.61,36.22 | v69.6,49.82 72.61,49.82
  pour VCC: 0,61.82 101.6,61.82 101.6,0.22 0,0.22
(copper drawn outside any net)
  shapes: Top area x5

### Text on the board
tNames: nervus 2015 / fan controller / v 3.0